# EAGLE design module_SX1262 (EAGLE 9.4.1)
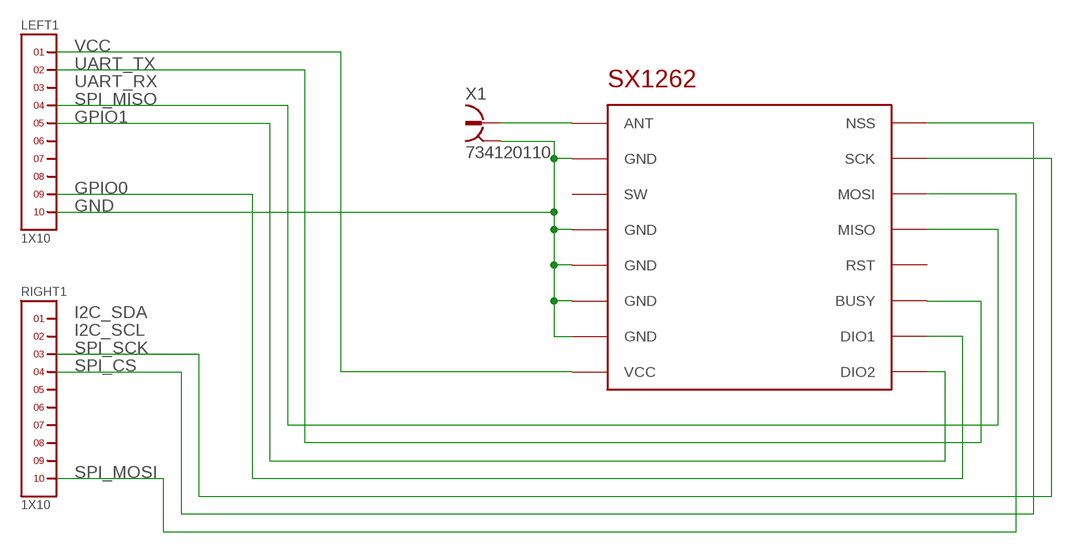
[diagram p0: schematic, sheet 1]

## Parts
LEFT1  1X10  [1X10]
RIGHT1  1X10  [1X10]
U$1  SX1262  [SX1262]
X1  734120110  [734120110]

## Nets
GND: LEFT1.10 U$1.GND@1(GND) U$1.GND@2(GND) U$1.GND@3(GND) U$1.GND@4(GND) U$1.GND@5(GND) X1.S@1 X1.S@2 X1.S@3
N$2: RIGHT1.10 U$1.MOSI
N$3: RIGHT1.4 U$1.NSS
N$4: RIGHT1.3 U$1.SCK
N$5: LEFT1.9 U$1.DIO1
N$6: LEFT1.5 U$1.DIO2
N$7: LEFT1.4 U$1.MISO
N$8: LEFT1.1 U$1.VCC
N$9: LEFT1.2 U$1.BUSY
N$10: U$1.ANT X1.1
Unconnected: LEFT1.3 LEFT1.6 LEFT1.7 LEFT1.8 RIGHT1.1 RIGHT1.2 RIGHT1.5 RIGHT1.6 RIGHT1.7 RIGHT1.8 RIGHT1.9 U$1.RST U$1.SW

## Notes on the sheet
- VCC
- UART_TX
- UART_RX
- SPI_MISO
- GPIO1
- GPIO0
- GND
- I2C_SDA
- I2C_SCL
- SPI_SCK
- SPI_CS
- SPI_MOSI

## Library data of the parts
LEFT1 RIGHT1 = headers(2mm):1X10
U$1 = RadioShield:SX1262
X1 = con-coax:734120110: MICRO COAXIAL CONNECTOR RECEPTACLE VERTICAL Source: Data sheet <http://www.molex.com/pdm_docs/sd/734120110_sd.pdf>

## Board
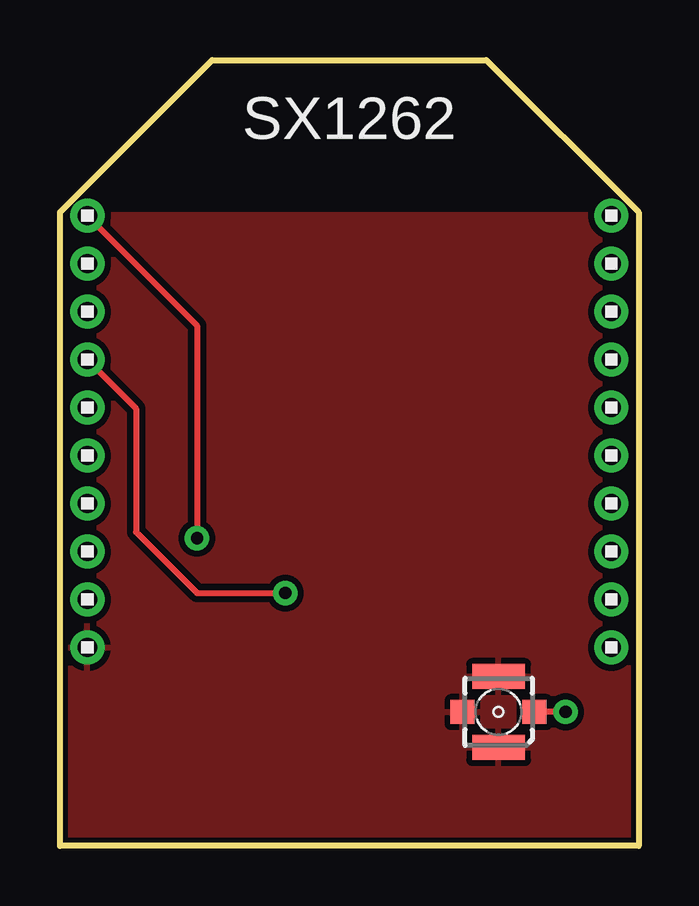
[diagram p1: board, top side]
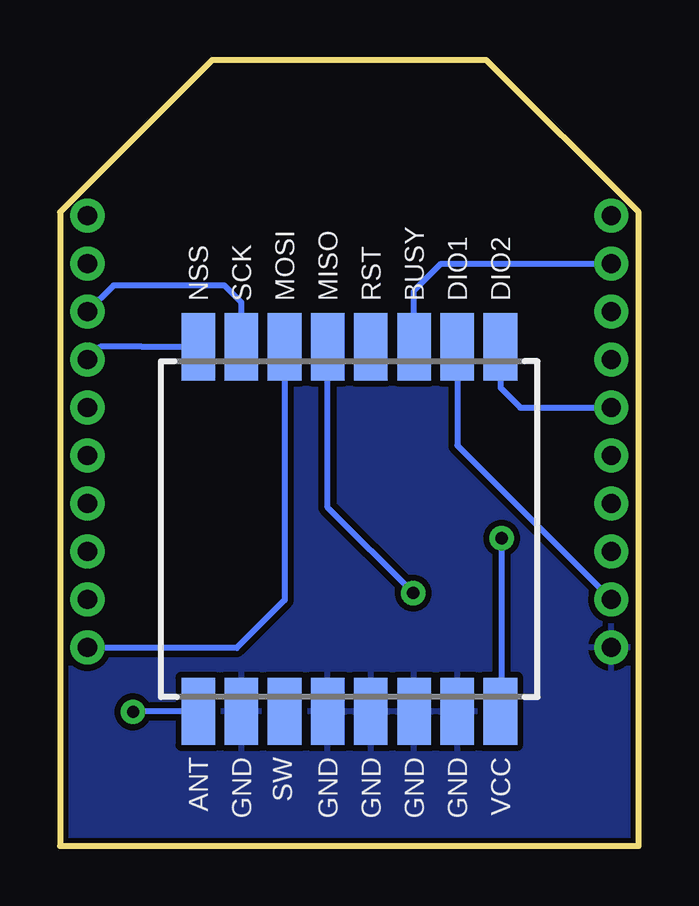
[diagram p2: board, bottom side, seen from below]

Size 24.13 x 32.77 mm. Coordinates in mm from the lower left corner, seen from the top.
Outline: 0,0 0,26.42 6.35,32.77 17.78,32.77 24.13,26.42 24.13,0 0,0
Copper layers (1*16): Top 0.035mm / dielectric 1.5mm / Bottom 0.035mm
Design rules "SparkFun-2-layer-STANDARD": minimum track width 10mil, minimum drill 20mil, track to track 10mil, track to pad 8mil, pad to pad 8mil, via to via 10mil, smd to smd 8mil, copper to edge 8mil, drill to drill 8mil, minimum pad ring 10mil, minimum via ring 10mil, stop-mask expansion 4mil, vias tented up to drill 25mil, thermal gap 10mil

### Footprints (pad centres in the part's own frame; a part is rotated, then mirrored left to right if it is on the bottom)
1X10 = drill 0.8 pad 1.422: 1 -9,0; 2 -7,0; 3 -5,0; 4 -3,0; 5 -1,0; 6 1,0; 7 3,0; 8 5,0; 9 7,0; 10 9,0
SX1262 = smd 2.8 x 1.4: ANT -7.6,6.3; BUSY 7.6,-2.7; DIO1 7.6,-4.5; DIO2 7.6,-6.3; GND@1 -7.6,4.5; GND@2 -7.6,0.9; GND@3 -7.6,-0.9; GND@4 -7.6,-2.7; GND@5 -7.6,-4.5; MISO 7.6,0.9; MOSI 7.6,2.7; NSS 7.6,6.3; RST 7.6,-0.9; SCK 7.6,4.5; SW -7.6,2.7; VCC -7.6,-6.3
734120110 = smd 1 x 1: 1 0,-1.5; S@1 0,1.5 | smd 1.05 x 2.2: S@2 -1.475,0; S@3 1.475,0

### Placement (x,y rotation side)
LEFT1  1.14,17.27 270 top
RIGHT1  22.99,17.27 270 top
U$1  12.06,13.21 90 bottom
X1  18.29,5.59 90 top

### Tracks (layer width: path | path; a pad name or v marks a point on that pad's centre or on a via)
GND
  pour Top: -0.25,-0.25 24.38,-0.25 24.38,26.29 -0.25,26.29
  pour Bottom: -0.51,-0.51 24.64,-0.51 24.64,26.29 -0.51,26.29
N$2
  Bottom 0.254: U$1.MOSI 14.76,10.25 16.76,8.25 22.97,8.25 RIGHT1.10
N$3
  Bottom 0.254: U$1.NSS 20.7,20.81 20.72,20.81 22.45,20.81 RIGHT1.4
N$4
  Bottom 0.254: U$1.SCK 16.57,22.66 17.27,23.37 21.89,23.37 RIGHT1.3
N$5
  Bottom 0.254: U$1.DIO1 7.57,16.69 LEFT1.9
N$6
  Bottom 0.254: U$1.DIO2 5.77,19.1 4.94,18.27 LEFT1.5
N$7  (via drill 0.51)
  Top 0.254: LEFT1.4 3.17,18.24 3.17,13.08 5.71,10.54 v9.4,10.54
  Bottom 0.254: v9.4,10.54 12.96,14.11 U$1.MISO
N$8  (via drill 0.51)
  Top 0.254: LEFT1.1 5.71,21.7 v5.71,12.83
  Bottom 0.254: v5.71,12.83 5.71,5.66 U$1.VCC
N$9
  Bottom 0.254: LEFT1.2 8.24,24.27 9.37,23.15 U$1.BUSY
N$10  (via drill 0.51)
  Top 0.254: v21.08,5.59 X1.1
  Bottom 0.254: U$1.ANT 21.06,5.61 v21.08,5.59

### Text on the board
tNames: SX1262